# Altium schematic sheet Schematic.SchDoc
size A; SheetNumber: 1; SheetTotal: 1
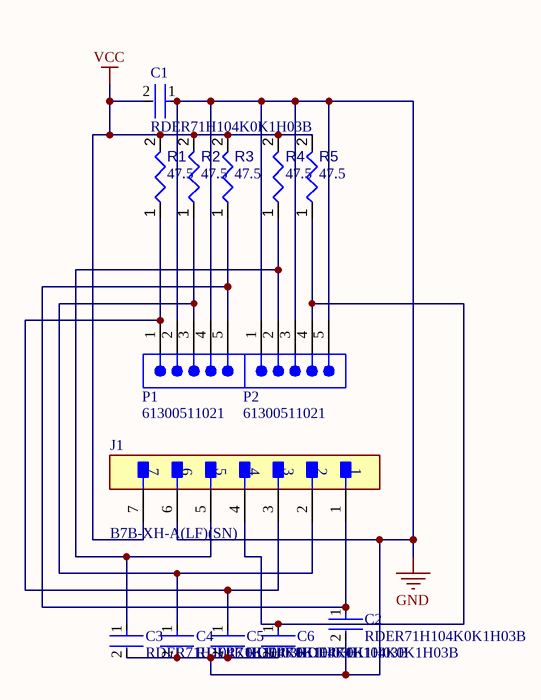
[diagram p0: Schematic.SchDoc]

## Parts
C1  RDER71H104K0K1H03B  [FP-RDE0M1-MFG]
C2  RDER71H104K0K1H03B  [FP-RDE0M1-MFG]
C3  RDER71H104K0K1H03B  [FP-RDE0M1-MFG]
C4  RDER71H104K0K1H03B  [FP-RDE0M1-MFG]
C5  RDER71H104K0K1H03B  [FP-RDE0M1-MFG]
C6  RDER71H104K0K1H03B  [FP-RDE0M1-MFG]
J1  B7B-XH-A(LF)(SN)  [FP-B7B-XH-A_LF_SN-MFG]
P1  61300511021  [61300511021]
P2  61300511021  [61300511021]
R1  value 47.5  [RESA60-630X240]  (hidden comment: MFR-25FBF52-47R5)
R2  value 47.5  [RESA60-630X240]  (hidden comment: MFR-25FBF52-47R5)
R3  value 47.5  [RESA60-630X240]  (hidden comment: MFR-25FBF52-47R5)
R4  value 47.5  [RESA60-630X240]  (hidden comment: MFR-25FBF52-47R5)
R5  value 47.5  [RESA60-630X240]  (hidden comment: MFR-25FBF52-47R5)

## Nets
GND: C1.1 C2.2 C3.2 C4.2 C5.2 C6.2 J1.6 P1.2 P1.4 P2.1 P2.3 P2.5
VCC: C1.2 J1.7 R1.2 R2.2 R3.2 R4.2 R5.2
NetC2_1: C2.1 J1.1 P1.5 R3.1
NetC3_1: C3.1 J1.5 P2.2 R4.1
NetC4_1: C4.1 J1.2 P1.3 R2.1
NetC5_1: C5.1 J1.3 P1.1 R1.1
NetC6_1: C6.1 J1.4 P2.4 R5.1

## Library data of the parts
C1-C6 = CMP-06035-023286-1: Ceramic Capacitor 100nF ±10% 50V X7R Radial; Lead/Base Style: Kinked; Lead Diameter: 0.5mm; Capacitance: 100nF; Width: 0.098inch; Height - Seated (Max): 0.236inch; Voltage Rating (DC): 50V; Min Operating Temperature: -55°C; Lead Pitch: 0.197inch; Mount: Through Hole; Max Operating Temperature: 125°C; Termination: Radial; Tolerance: 10%; Case/Package: Radial; Packaging: Bulk; Length: 0.157inch; Resistor Type: Ceramic; Lead Free: Lead Free; Package Quantity: 500; Dielectric: X7R; Voltage Rating: 50V; Height: 3.5mm
J1 = CMP-17439-000323-2: CONN HEADER VERT 7POS 2.5MM; Current Rating: 3A; Voltage Rating: 250V; Number of Contacts: 7; Mated Stacking Heights: 9.8mm; Insulation Resistance: 1GR; Contact Resistance: 20mR; Wire/Cable Gauge: 22AWG; Contact Finish - Mating: TIN; Orientation: Straight; REACH SVHC: No SVHC; Max Operating Temperature: 85°C; Housing Color: White; Pitch: 2.5mm; Mount: Through Hole; Packaging: Bulk; Depth: 5.75mm; Series: XH; Min Operating Temperature: -25°C; Length: 19.9mm; Connector Type: Header; Number of Positions: 7; Color: Natural; Max Current Rating: 3A; Lead Pitch: 2.5mm; Termination: Solder; Fastening Type: Detent; Flammability Rating: UL94 V-0; Voltage Rating (AC): 250V; Lead Free: Lead Free; Contact Material: Brass; Max Voltage Rating (AC): 250V; Contact Type: Male Pin; Housing Material: Polyamide; Insulation Color: Natural; Contact Shape: Square; Number of Rows: 1; Contact Plating: Tin; Insulation Material: Nylon
P1 P2 = CMP-1502-01067-3: NexarPartId: 32855525; Contact Resistance: 20mΩ; Current Rating: 3A; Number of Contacts: 5; Pitch: 2.54mm; Operating Supply Voltage: 250V; Connector Type: Male Pin; Gender: Male; Number of Rows: 1; Packaging: Bulk; REACH SVHC: Unknown; Mount: Through Hole; RoHS: Compliant; Termination: Solder; Contact Mating Length: 5.9944mm; Color: Black; Number of Positions: 5; Contact Plating: Gold; Number of Pins: 5; Contact Material: Copper; Lead Pitch: 2.54mm
R1-R5 = CMP-009-00058-4: Axial Resistor, 47.5 Ohm, +/- 1%, 0.25 W, -55 to 155 degC, 2-Pin THD, RoHS, Bulk; Manufacturer: Yageo; Voltage Rating: 250V; Power: 250mW; Packaging: Bulk; Package Description: 2-Pin Axial Lead, Dia 2.4 mm, Body Length 6.3 mm; Package Reference: MFR-25; Case/Package: Axial; Tolerance: 1%; RoHS Compliant: True; Package Quantity: 200; Max Operating Temperature: 155°C; Manufacturer URL: http://www.yageo.com/; Datasheet URL: http://www.yageo.com/documents/recent/Yageo%20LR_MFR_2013.pdf; Min Operating Temperature: -55°C; Datasheet Version: Apr-13; Mounting Technology: TH